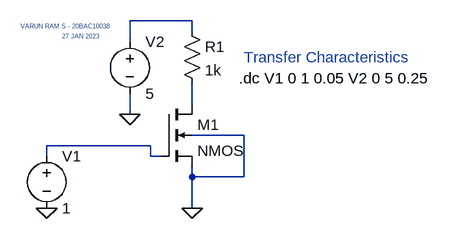
[diagram p0: schematic EXP1.asc]
EXP1.asc, the LTspice schematic file:
Version 4
SHEET 1 880 680
WIRE 224 -48 128 -48
WIRE 224 -32 224 -48
WIRE 128 -16 128 -48
WIRE 224 80 224 48
WIRE 128 96 128 64
WIRE 304 128 224 128
WIRE 160 144 0 144
WIRE 0 160 0 144
WIRE 160 160 160 144
WIRE 176 160 160 160
WIRE 224 192 224 176
WIRE 304 192 304 128
WIRE 304 192 224 192
WIRE 224 240 224 192
FLAG 224 240 0
FLAG 0 240 0
FLAG 128 96 0
SYMBOL voltage 0 144 R0
WINDOW 123 0 0 Left 0
WINDOW 39 0 0 Left 0
SYMATTR InstName V1
SYMATTR Value 1
SYMBOL voltage 128 -32 R0
WINDOW 123 0 0 Left 0
WINDOW 39 0 0 Left 0
SYMATTR InstName V2
SYMATTR Value 5
SYMBOL nmos4 176 80 R0
SYMATTR InstName M1
SYMATTR Value2 l=180n w=2u
SYMBOL res 208 -48 R0
SYMATTR InstName R1
SYMATTR Value 1k
TEXT 296 40 Left 2 !.dc V1 0 1 0.05 V2 0 5 0.25
TEXT 304 8 Left 2 ;Transfer Characteristics
TEXT -40 -40 Left 0 ;VARUN RAM S - 20BAC10038
TEXT 24 -24 Left 0 ;27 JAN 2023

The netlist it stands for:
* EXP1.asc
V1 N003 0 1
V2 N001 0 5
M1 N002 N003 0 0 NMOS l=180n w=2u
R1 N001 N002 1k
.model NMOS NMOS
.model PMOS PMOS
.lib standard.mos
.dc V1 0 1 0.05 V2 0 5 0.25
* Transfer Characteristics
* VARUN RAM S - 20BAC10038
* 27 JAN 2023
.backanno
.end